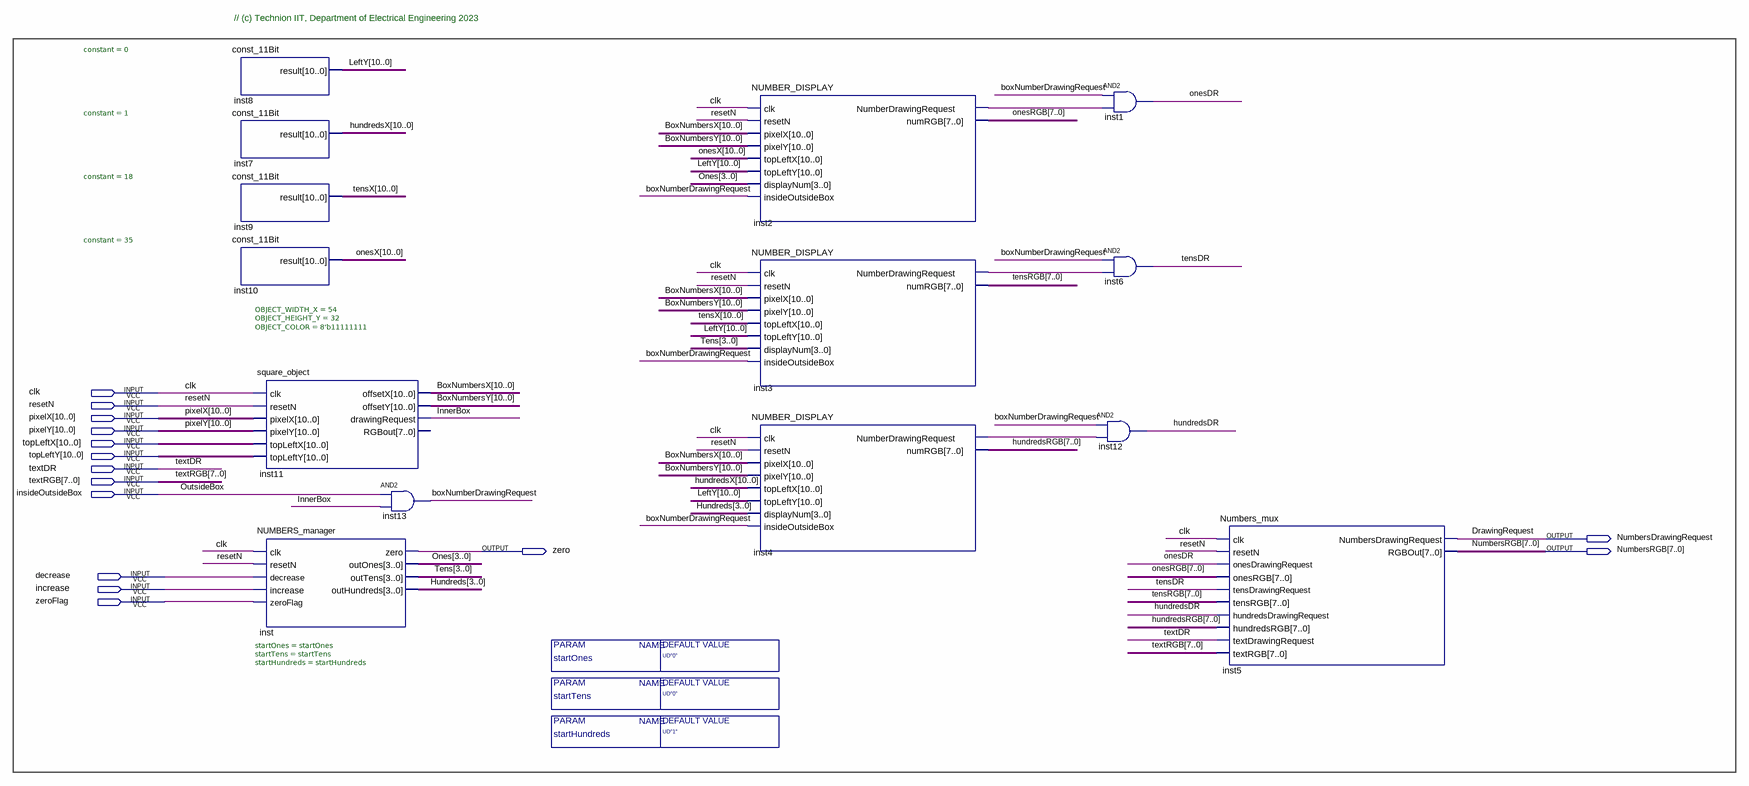
[diagram p0: schematic sheet]
// Quartus schematic NUMBERS_DISPLAY.bdf as structural Verilog: 14 symbols, 15 pins
module NUMBERS_DISPLAY #(parameter startOnes = "UD\"0\"", parameter startTens = "UD\"0\"", parameter startHundreds = "UD\"1\"") (
  input  clk,
  input  resetN,
  input  [10:0] pixelX,
  input  [10:0] pixelY,
  input  [10:0] topLeftX,
  input  [10:0] topLeftY,
  input  textDR,
  input  [7:0] textRGB,
  input  insideOutsideBox,
  input  decrease,
  input  increase,
  input  zeroFlag,
  output NumbersDrawingRequest,
  output zero,
  output [7:0] NumbersRGB
);

  wire boxNumberDrawingRequest, hundredsDR, InnerBox, inst2_numberdrawingrequest, inst3_numberdrawingrequest,
       inst4_numberdrawingrequest, onesDR, tensDR;
  wire [3:0] Hundreds, Ones, Tens;
  wire [7:0] hundredsRGB, onesRGB, tensRGB;
  wire [10:0] BoxNumbersX, BoxNumbersY, hundredsX, LeftY, onesX, tensX;

  const_11Bit #(.constant(0)) inst8 (.result(LeftY));
  const_11Bit #(.constant(1)) inst7 (.result(hundredsX));
  const_11Bit #(.constant(18)) inst9 (.result(tensX));
  const_11Bit #(.constant(35)) inst10 (.result(onesX));
  square_object #(.OBJECT_WIDTH_X(54), .OBJECT_HEIGHT_Y(32), .OBJECT_COLOR(8'b11111111)) inst11 (
    .clk(clk), .resetN(resetN), .pixelX(pixelX), .pixelY(pixelY), .topLeftX(topLeftX), .topLeftY(topLeftY),
    .offsetX(BoxNumbersX), .offsetY(BoxNumbersY), .drawingRequest(InnerBox));  // open: RGBout
  NUMBERS_manager #(.startOnes(startOnes), .startTens(startTens), .startHundreds(startHundreds)) inst (
    .clk(clk), .resetN(resetN), .decrease(decrease), .increase(increase), .zeroFlag(zeroFlag), .zero(zero),
    .outOnes(Ones), .outTens(Tens), .outHundreds(Hundreds));
  and inst13 (boxNumberDrawingRequest, insideOutsideBox, InnerBox);
  NUMBER_DISPLAY inst2 (
    .clk(clk), .resetN(resetN), .pixelX(BoxNumbersX), .pixelY(BoxNumbersY), .topLeftX(onesX),
    .topLeftY(LeftY), .displayNum(Ones), .insideOutsideBox(boxNumberDrawingRequest),
    .NumberDrawingRequest(inst2_numberdrawingrequest), .numRGB(onesRGB));
  NUMBER_DISPLAY inst3 (
    .clk(clk), .resetN(resetN), .pixelX(BoxNumbersX), .pixelY(BoxNumbersY), .topLeftX(tensX),
    .topLeftY(LeftY), .displayNum(Tens), .insideOutsideBox(boxNumberDrawingRequest),
    .NumberDrawingRequest(inst3_numberdrawingrequest), .numRGB(tensRGB));
  NUMBER_DISPLAY inst4 (
    .clk(clk), .resetN(resetN), .pixelX(BoxNumbersX), .pixelY(BoxNumbersY), .topLeftX(hundredsX),
    .topLeftY(LeftY), .displayNum(Hundreds), .insideOutsideBox(boxNumberDrawingRequest),
    .NumberDrawingRequest(inst4_numberdrawingrequest), .numRGB(hundredsRGB));
  and inst1 (onesDR, boxNumberDrawingRequest, inst2_numberdrawingrequest);
  and inst6 (tensDR, boxNumberDrawingRequest, inst3_numberdrawingrequest);
  and inst12 (hundredsDR, boxNumberDrawingRequest, inst4_numberdrawingrequest);
  Numbers_mux inst5 (
    .clk(clk), .resetN(resetN), .onesDrawingRequest(onesDR), .onesRGB(onesRGB), .tensDrawingRequest(tensDR),
    .tensRGB(tensRGB), .hundredsDrawingRequest(hundredsDR), .hundredsRGB(hundredsRGB),
    .textDrawingRequest(textDR), .textRGB(textRGB), .NumbersDrawingRequest(NumbersDrawingRequest),
    .RGBOut(NumbersRGB));

  // Other names for the same wires on the sheet: DrawingRequest = NumbersDrawingRequest;
  //   OutsideBox = insideOutsideBox

  // Notes on the sheet:
  //   // (c) Technion IIT, Department of Electrical Engineering 2023
endmodule
